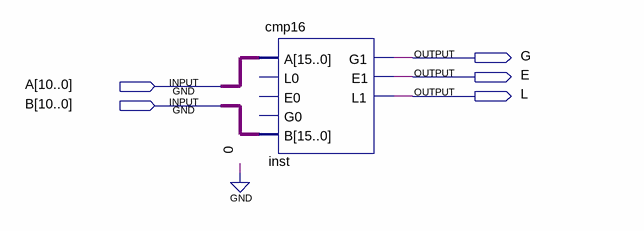
[diagram p0: schematic sheet]
// Quartus schematic cmp11u.bdf as structural Verilog: 1 symbols, 5 pins
module cmp11u (
  input  [10:0] A,
  input  [10:0] B,
  output G,
  output E,
  output L
);

  cmp16 inst (.A({{5{1'b0}}, A}), .B({{5{1'b0}}, B}), .G1(G), .E1(E), .L1(L));  // open: L0, E0, G0
endmodule
